# Altium schematic sheet arm.SchDoc
size 297 x 209 mm
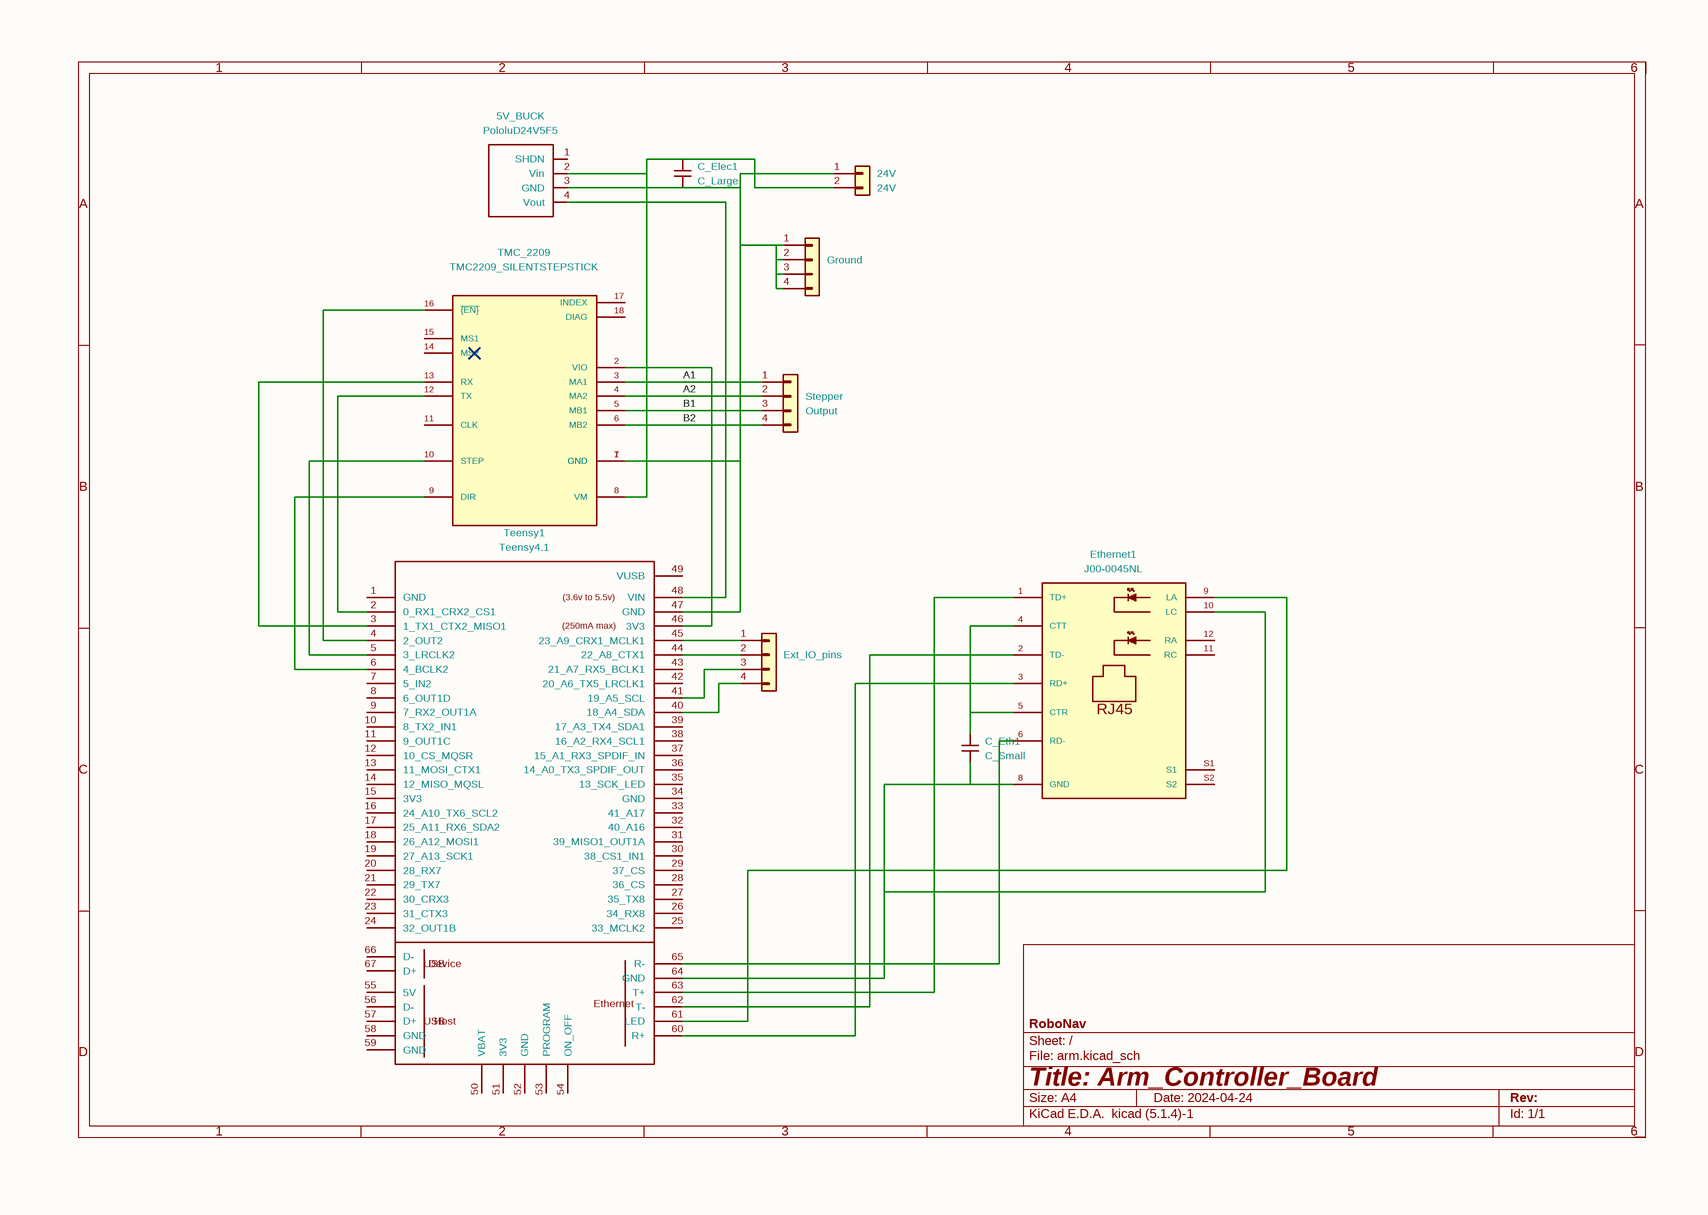
[diagram p0: arm.SchDoc]

## Parts
5V_BUCK  PololuD24V5F5  [PinHeader_1x04_P2.54mm_Vertical]
24V  24V  [SolderWire-0.5sqmm_1x02_P4.6mm_D0.9mm_OD2.1mm_Relief]
C_Elec1  C_Large  [CP_Radial_D4.0mm_P1.50mm]
C_Eth1  C_Small  [C_Disc_D3.0mm_W1.6mm_P2.50mm]
Ethernet1  J00-0045NL  [PULSE_J00-0045NL]
Ext_IO_pins  Output  [PinHeader_1x04_P2.54mm_Vertical]  (value not drawn)
Ground  Output  [PinHeader_1x04_P2.54mm_Vertical]  (value not drawn)
Stepper  Output  [PinHeader_1x04_P2.54mm_Vertical]
Teensy1  Teensy4.1  [Teensy41]
TMC_2209  TMC2209_SILENTSTEPSTICK

## Nets
A1: Stepper.1(Pin_1) TMC_2209.3(MA1)
A2: Stepper.2(Pin_2) TMC_2209.4(MA2)
B1: Stepper.3(Pin_3) TMC_2209.5(MB1)
B2: Stepper.4(Pin_4) TMC_2209.6(MB2)
Net5V_BUCK_2: 5V_BUCK.2(Vin) 24V.2(Pin_2) C_Elec1.1 TMC_2209.8(VM)
Net5V_BUCK_3: 5V_BUCK.3(GND) 24V.1(Pin_1) C_Elec1.2 Ground.1(Pin_1) Ground.2(Pin_2) Ground.3(Pin_3) Ground.4(Pin_4) Teensy1.47(GND) TMC_2209.1(GND) TMC_2209.7(GND)
Net5V_BUCK_4: 5V_BUCK.4(Vout) Teensy1.48(VIN)
NetC_Eth1_1: C_Eth1.1 Ethernet1.4(CTT) Ethernet1.5(CTR)
NetC_Eth1_2: C_Eth1.2 Ethernet1.8(GND) Ethernet1.10(LC) Teensy1.64(GND)
NetEthernet1_1: Ethernet1.1(TD+) Teensy1.63(T+)
NetEthernet1_2: Ethernet1.2(TD-) Teensy1.62(T-)
NetEthernet1_3: Ethernet1.3(RD+) Teensy1.60(R+)
NetEthernet1_6: Ethernet1.6(RD-) Teensy1.65(R-)
NetEthernet1_9: Ethernet1.9(LA) Teensy1.61(LED)
NetExt_IO_pins_1: Ext_IO_pins.1(Pin_1) Teensy1.45(23_A9_CRX1_MCLK1)
NetExt_IO_pins_2: Ext_IO_pins.2(Pin_2) Teensy1.44(22_A8_CTX1)
NetExt_IO_pins_3: Ext_IO_pins.3(Pin_3) Teensy1.41(19_A5_SCL)
NetExt_IO_pins_4: Ext_IO_pins.4(Pin_4) Teensy1.40(18_A4_SDA)
NetTeensy1_2: Teensy1.2(0_RX1_CRX2_CS1) TMC_2209.12(TX)
NetTeensy1_3: Teensy1.3(1_TX1_CTX2_MISO1) TMC_2209.13(RX)
NetTeensy1_4: Teensy1.4(2_OUT2) TMC_2209.16(~{{EN}})
NetTeensy1_5: Teensy1.5(3_LRCLK2) TMC_2209.10(STEP)
NetTeensy1_6: Teensy1.6(4_BCLK2) TMC_2209.9(DIR)
NetTeensy1_46: Teensy1.46(3V3) TMC_2209.2(VIO)

Not connected (* = marked no-connect by the designer): 5V_BUCK 1(SHDN); Ethernet1 11(RC) 12(RA) S1 S2; Teensy1 1(GND) 7(5_IN2) 8(6_OUT1D) 9(7_RX2_OUT1A) 10(8_TX2_IN1) 11(9_OUT1C) 12(10_CS_MQSR) 13(11_MOSI_CTX1) 14(12_MISO_MQSL) 15(3V3) 16(24_A10_TX6_SCL2) 17(25_A11_RX6_SDA2) 18(26_A12_MOSI1) 19(27_A13_SCK1) 20(28_RX7) 21(29_TX7) 22(30_CRX3) 23(31_CTX3) 24(32_OUT1B) 25(33_MCLK2) 26(34_RX8) 27(35_TX8) 28(36_CS) 29(37_CS) 30(38_CS1_IN1) 31(39_MISO1_OUT1A) 32(40_A16) 33(41_A17) 34(GND) 35(13_SCK_LED) 36(14_A0_TX3_SPDIF_OUT) 37(15_A1_RX3_SPDIF_IN) 38(16_A2_RX4_SCL1) 39(17_A3_TX4_SDA1) 42(20_A6_TX5_LRCLK1) 43(21_A7_RX5_BCLK1) 49(VUSB) 50(VBAT) 51(3V3) 52(GND) 53(PROGRAM) 54(ON_OFF) 55(5V) 56(D-) 57(D+) 58(GND) 59(GND) 66(D-) 67(D+); TMC_2209 11(CLK) 14(MS2) 15(MS1) 17(INDEX) 18(DIAG)

## Notes on the sheet
- 1
- 2
- 3
- 4
- 5
- 6
- A
- B
- C
- D
- Title: Arm_Controller_Board
- File: arm.kicad_sch
- Sheet: /
- RoboNav
- KiCad E.D.A.  kicad (5.1.4)-1
- Size: A4
- Date: 2024-04-24
- Rev:
- Id: 1/1
- (in symbol J00-0045NL) RJ45
- (in symbol Teensy4.1) (3.6v to 5.5v); (250mA max); USB; Device; Ethernet; Host

## Library data of the parts
5V_BUCK = D24V5F5: Value: PololuD24V5F5; Footprint: Connector_PinHeader_2.54mm:PinHeader_1x04_P2.54mm_Vertical
24V = Conn_01x02: Description: Generic connector, single row, 01x02, script generated (kicad-library-utils/schlib/autogen/connector/); Value: 24V; Footprint: Connector_Wire:SolderWire-0.5sqmm_1x02_P4.6mm_D0.9mm_OD2.1mm_Relief
C_Elec1 C_Eth1 = C_Small: Description: Unpolarized capacitor, small symbol
  C_Elec1: Value: C_Large; Footprint: Capacitor_THT:CP_Radial_D4.0mm_P1.50mm
  C_Eth1: Value: C_Small; Footprint: Capacitor_THT:C_Disc_D3.0mm_W1.6mm_P2.50mm
Ethernet1 = J00-0045NL: MF: Pulse Electronics; DESCRIPTION: Conn RJ-45 Integrated Magnetics F 8 POS 2.54mm Solder RA Thru-Hole 12 Terminal 1 Port Cat 5/Cat 6; Description_1: \n1 Port RJ45 Magjack Connector Through Hole 10/100 Base-TX, AutoMDIX\n; PACKAGE: None; Price: None; Package: None; Check_prices: https://www.snapeda.com/parts/J00-0045NL/Pulse+Electronics+Network/view-part/?ref=eda; SnapEDA_Link: https://www.snapeda.com/parts/J00-0045NL/Pulse+Electronics+Network/view-part/?ref=snap; MP: J00-0045NL; Purchase-URL: https://www.snapeda.com/api/url_track_click_mouser/?unipart_id=87956&manufacturer=Pulse Electronics&part_name=J00-0045NL&search_term=None; Availability: In Stock; Value: J00-0045NL; Footprint: EthernetConn:PULSE_J00-0045NL
Ext_IO_pins Ground Stepper = Conn_01x04: Description: Generic connector, single row, 01x04, script generated (kicad-library-utils/schlib/autogen/connector/); Value: Output; Footprint: Connector_PinHeader_2.54mm:PinHeader_1x04_P2.54mm_Vertical
TMC_2209 = TMC2209_SILENTSTEPSTICK: SNAPEDA_PN: TMC2209 SILENTSTEPSTICK; Value: TMC2209_SILENTSTEPSTICK
Teensy1 = Teensy4.1: Value: Teensy4.1; Footprint: Teensy:Teensy41